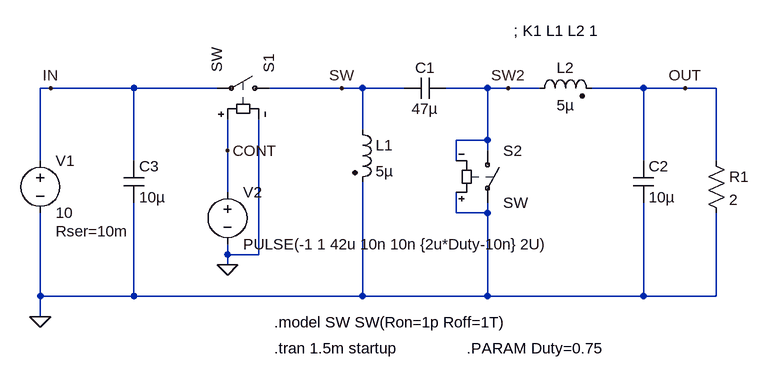
[diagram p0: schematic Fig_7-34_Zeta.asc]
Fig_7-34_Zeta.asc, the LTspice schematic file:
Version 4
SHEET 1 880 680
WIRE -240 112 -256 112
WIRE -112 112 -240 112
WIRE 16 112 -112 112
WIRE 208 112 96 112
WIRE 240 112 208 112
WIRE 304 112 240 112
WIRE 432 112 368 112
WIRE 464 112 432 112
WIRE 512 112 464 112
WIRE 672 112 592 112
WIRE 736 112 672 112
WIRE 784 112 736 112
WIRE 240 176 240 112
WIRE 432 192 432 112
WIRE 432 192 384 192
WIRE 32 208 32 160
WIRE 432 208 432 192
WIRE -256 224 -256 112
WIRE -112 224 -112 112
WIRE 384 224 384 192
WIRE 672 224 672 112
WIRE 784 224 784 112
WIRE 32 272 32 208
WIRE 384 304 384 272
WIRE 432 304 432 288
WIRE 432 304 384 304
WIRE 32 368 32 352
WIRE 80 368 80 160
WIRE 80 368 32 368
WIRE 32 384 32 368
WIRE -256 432 -256 304
WIRE -112 432 -112 288
WIRE -112 432 -256 432
WIRE 240 432 240 256
WIRE 240 432 -112 432
WIRE 432 432 432 304
WIRE 432 432 240 432
WIRE 672 432 672 288
WIRE 672 432 432 432
WIRE 784 432 784 304
WIRE 784 432 672 432
WIRE -256 464 -256 432
FLAG 32 384 0
FLAG -256 464 0
FLAG 736 112 OUT
FLAG -240 112 IN
FLAG 208 112 SW
FLAG 464 112 SW2
FLAG 32 208 CONT
SYMBOL sw 112 112 M270
SYMATTR InstName S1
SYMBOL sw 432 192 R0
SYMATTR InstName S2
SYMBOL ind2 224 160 R0
SYMATTR InstName L1
SYMATTR Value 5µ
SYMATTR Type ind
SYMBOL ind2 496 128 R270
WINDOW 0 32 56 VTop 2
WINDOW 3 5 56 VBottom 2
SYMATTR InstName L2
SYMATTR Value 5µ
SYMATTR Type ind
SYMBOL cap 304 128 R270
WINDOW 0 32 32 VTop 2
WINDOW 3 0 32 VBottom 2
SYMATTR InstName C1
SYMATTR Value 47µ
SYMBOL cap 656 224 R0
SYMATTR InstName C2
SYMATTR Value 10µ
SYMBOL res 768 208 R0
SYMATTR InstName R1
SYMATTR Value 2
SYMBOL voltage -256 208 R0
WINDOW 123 0 0 Left 2
WINDOW 39 24 124 Left 2
SYMATTR SpiceLine Rser=10m
SYMATTR InstName V1
SYMATTR Value 10
SYMBOL voltage 32 256 R0
WINDOW 123 24 138 Left 2
WINDOW 39 24 117 Left 2
SYMATTR Value PULSE(-1 1 42u 10n 10n {2u*Duty-10n} 2U)
SYMATTR InstName V2
SYMBOL cap -128 224 R0
SYMATTR InstName C3
SYMATTR Value 10µ
TEXT 104 472 Left 2 !.model SW SW(Ron=1p Roff=1T)
TEXT 472 24 Left 2 !; K1 L1 L2 1
TEXT 104 512 Left 2 !.tran 1.5m startup
TEXT 400 512 Left 2 !.PARAM Duty=0.75

The netlist it stands for:
* Fig_7-34_Zeta.asc
S1 SW IN CONT 0 SW
S2 SW2 0 0 SW2 SW
L1 SW 0 5µ
L2 SW2 OUT 5µ
C1 SW SW2 47µ
C2 OUT 0 10µ
R1 OUT 0 2
V1 IN 0 10 Rser=10m
V2 CONT 0 PULSE(-1 1 42u 10n 10n {2u*Duty-10n} 2U)
C3 IN 0 10µ
.model SW SW(Ron=1p Roff=1T)
; K1 L1 L2 1
.tran 1.5m startup
.PARAM Duty=0.75
.backanno
.end